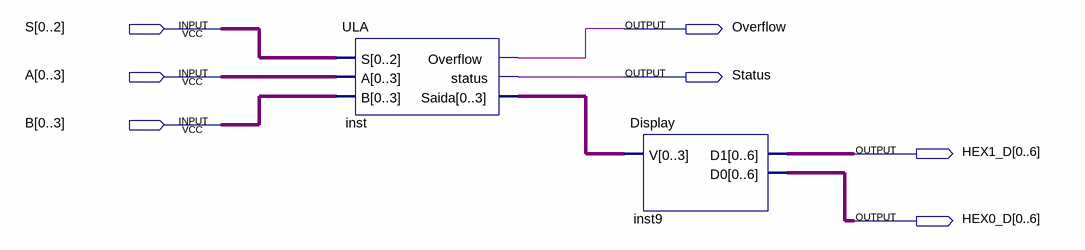
[diagram p0: schematic sheet]
// Quartus schematic Assembled_ULA.bdf as structural Verilog: 2 symbols, 7 pins
module Assembled_ULA (
  input  [0:2] S,
  input  [0:3] A,
  input  [0:3] B,
  output Overflow,
  output Status,
  output [0:6] HEX1_D,
  output [0:6] HEX0_D
);

  wire [3:0] inst_saida;

  ULA inst (.S(S), .A(A), .B(B), .Overflow(Overflow), .status(Status), .Saida(inst_saida));
  Display inst9 (.V(inst_saida), .D1(HEX1_D), .D0(HEX0_D));
endmodule
